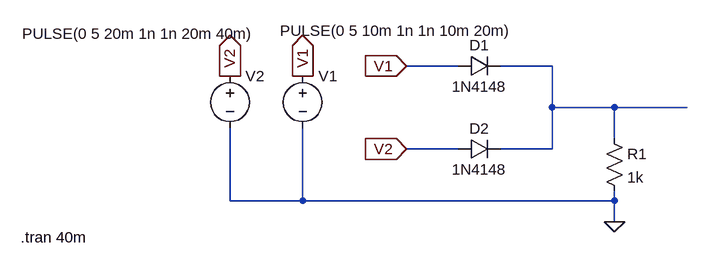
[diagram p0: schematic OR_Gate.asc]
OR_Gate.asc, the LTspice schematic file:
Version 4
SHEET 1 880 680
WIRE -272 -32 -352 -32
WIRE -128 -32 -208 -32
WIRE -128 32 -128 -32
WIRE -32 32 -128 32
WIRE 80 32 -32 32
WIRE -32 80 -32 32
WIRE -272 96 -352 96
WIRE -128 96 -128 32
WIRE -128 96 -208 96
WIRE -624 176 -624 64
WIRE -512 176 -512 64
WIRE -512 176 -624 176
WIRE -32 176 -32 160
WIRE -32 176 -512 176
WIRE -32 208 -32 176
FLAG -32 208 0
FLAG -352 -32 V1
IOPIN -352 -32 In
FLAG -352 96 V2
IOPIN -352 96 In
FLAG -512 -16 V1
IOPIN -512 -16 Out
FLAG -624 -16 V2
IOPIN -624 -16 Out
SYMBOL diode -272 -16 R270
WINDOW 0 32 32 VTop 2
WINDOW 3 0 32 VBottom 2
SYMATTR InstName D1
SYMATTR Value 1N4148
SYMBOL diode -272 112 R270
WINDOW 0 32 32 VTop 2
WINDOW 3 0 32 VBottom 2
SYMATTR InstName D2
SYMATTR Value 1N4148
SYMBOL res -48 64 R0
SYMATTR InstName R1
SYMATTR Value 1k
SYMBOL voltage -512 -32 R0
WINDOW 3 -35 -54 Left 2
WINDOW 123 0 0 Left 0
WINDOW 39 0 0 Left 0
SYMATTR InstName V1
SYMATTR Value PULSE(0 5 10m 1n 1n 10m 20m)
SYMBOL voltage -624 -32 R0
WINDOW 3 -320 -50 Left 2
WINDOW 123 0 0 Left 0
WINDOW 39 0 0 Left 0
SYMATTR InstName V2
SYMATTR Value PULSE(0 5 20m 1n 1n 20m 40m)
TEXT -946 232 Left 2 !.tran 40m

The netlist it stands for:
* OR_Gate.asc
D1 V1 N001 1N4148
D2 V2 N001 1N4148
R1 N001 0 1k
V1 V1 0 PULSE(0 5 10m 1n 1n 10m 20m)
V2 V2 0 PULSE(0 5 20m 1n 1n 20m 40m)
.model D D
.lib standard.dio
.tran 40m
.backanno
.end